# EasyEDA Pro project TK-KB1.eprj

# Schematic Schematic
Create Date: 2023-05-25; Page Name: P1; Project Name: TK-KB1; Schematic Name: Schematic; Update Date: 2023-05-25; Company: 亿航创客; Drawed: 樱落Eglo; Page Size: A5; Version: V1.1
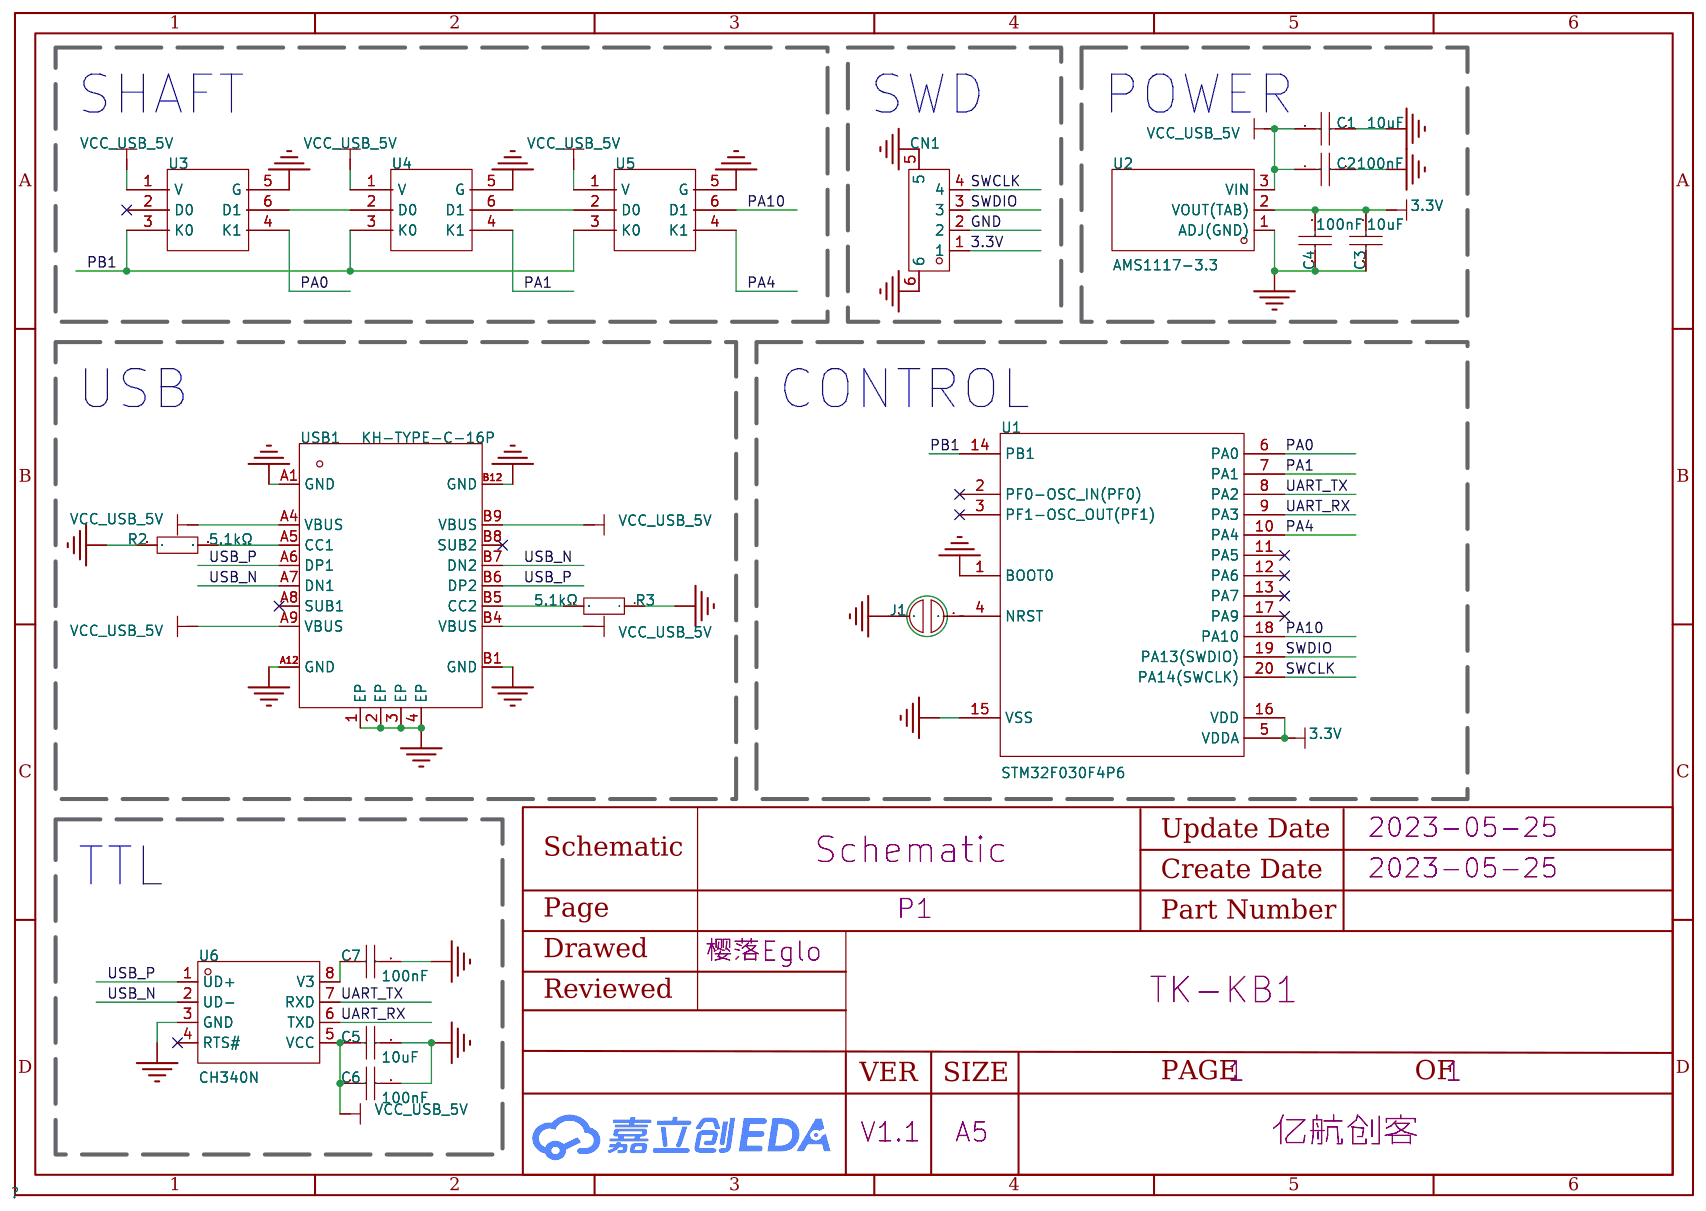
[diagram p0: schematic sheet]

## Parts
C1  10uF  [C0402]
C2  100nF  [C0402]
C3  10uF  [C0402]
C4  100nF  [C0402]
C5  10uF  [C0402]
C6  100nF  [C0402]
C7  100nF  [C0402]
CN1  HDGC1002WR-S-4P  [CONN-SMD_4P-P1.00_HDGC_HDGC1002WR-S-4P]
J1  -  [R0402]
R2  5.1kΩ  [R0402]
R3  5.1kΩ  [R0402]
U1  STM32F030F4P6  [TSSOP-20_L6.5-W4.4-P0.65-LS6.4-BL]
U2  AMS1117-3.3  [SOT-89_L4.5-W2.5-P1.50-LS4.2-BR]
U3  -  [凯华轴座+3528反贴灯]
U4  -  [凯华轴座+3528反贴灯]
U5  -  [凯华轴座+3528反贴灯]
U6  CH340N  [SOP-8_L4.9-W3.9-P1.27-LS6.0-BL]
USB1  KH-TYPE-C-16P  [USB-C-SMD_KH-TYPE-C-16P]

## Library data of the parts
C1 C3 C5 = CL05A106MQ5NUNC: 容值:10uF;精度:±20%;额定电压:6.3V;材质(温度系数):X5R;; LCSC Part Name: 10uF ±20% 6.3V; Supplier Part: C15525; Manufacturer: SAMSUNG(三星); Supplier Footprint: 0402; JLCPCB Part Class: Basic Part; Datasheet: https://atta.szlcsc.com/upload/public/pdf/source/20220823/2B02EE04F8F211D38A52DCB16EB6BEBA.pdf; Supplier: LCSC; Tolerance: ±20%; Voltage Rated: 6.3V; Temperature Coefficient: X5R
C2 C4 C6 C7 = CL05B104KO5NNNC: 容值:100nF;精度:±10%;额定电压:16V;材质(温度系数):X7R;; LCSC Part Name: 100nF ±10% 16V; Supplier Part: C1525; Manufacturer: SAMSUNG(三星); Supplier Footprint: 0402; JLCPCB Part Class: Basic Part; Datasheet: https://atta.szlcsc.com/upload/public/pdf/source/20160103/1457707674891.pdf; Supplier: LCSC; Tolerance: ±10%; Voltage Rated: 16V; Temperature Coefficient: X7R
CN1 = HDGC1002WR-S-4P: SH1.0针座卧贴 4P; LCSC Part Name: SH1.0针座卧贴 4P; Supplier Part: C2936214; Manufacturer: HDGC(华德共创); Supplier Footprint: SMD,P=1mm; JLCPCB Part Class: Extended Part; Datasheet: https://atta.szlcsc.com/upload/public/pdf/source/20211229/E8A09E85670B5E97244D2008A24D97FE.pdf; Supplier: LCSC
J1 = Jumper: 飞线
R2 R3 = 0402WGF5101TCE: 电阻类型:厚膜电阻;阻值:5.1kΩ;精度:±1%;功率:62.5mW;; LCSC Part Name: 5.1kΩ ±1% 62.5mW; Supplier Part: C25905; Manufacturer: UNI-ROYAL(厚声); Supplier Footprint: 0402; JLCPCB Part Class: Basic Part; Datasheet: https://atta.szlcsc.com/upload/public/pdf/source/20200306/C422600_1E6D84923E4A46A82E41ADD87F860B5C.pdf; Supplier: LCSC; Type: 厚膜电阻; Tolerance: ±1%; Power(Watts): 62.5mW; Temperature Coefficient: ±100ppm/℃; Overload Voltage (Max): 50V; Operating Temperature Range: -55℃~+155℃
U1 = STM32F030F4P6: CPU内核:ARM Cortex-M0;CPU最大主频:48MHz;程序存储容量:16KB;程序存储器类型:FLASH;RAM总容量:4KB;GPIO端口数量:15;; LCSC Part Name: ARM Cortex-M0 48MHz; Supplier Part: C32908; Manufacturer: ST(意法半导体); Supplier Footprint: TSSOP-20; JLCPCB Part Class: Extended Part; Datasheet: https://atta.szlcsc.com/upload/public/pdf/source/20140704/1457707098580.pdf; Supplier: LCSC; CPU Core: ARM Cortex-M0; CPU Maximum Speed: 48MHz; Operating Voltage Range: 2.4V~3.6V; Program Storage Size: 16KB; Program Memory Type: FLASH; RAM Size: 4KB; GPIO Ports Number: 15; ADC (Bit): 12bit; Watchdog: 有; Low-Voltage Detect: 有; Direct Memory Access: 有; Internal Oscillator: 有; Operating Temperature Range: -40℃~+85℃
U2 = AMS1117-3.3_C347256: 输出类型:固定;输出极性:正;最大输入电压:18V;输出电压:3.3V;输出电流:1A;电源纹波抑制比(PSRR):60dB@(120Hz);; LCSC Part Name: 输入18V 输出3.3V 1A; Supplier Part: C347256; Manufacturer: UMW(广东友台半导体); Supplier Footprint: SOT-89; JLCPCB Part Class: Extended Part; Datasheet: https://atta.szlcsc.com/upload/public/pdf/source/20211011/50CC665C22E3A66C08379A4A74BDA25C.pdf; Supplier: LCSC; Output Type: 固定; Output Polarity: 正; Number of Outputs: 1; Maximum Input Voltage: 18V; Output Voltage: 3.3V; Dropout Voltage: 1.3V@(1A); Output Current: 1A; Power Supply Rejection Ratio (PSRR): 60dB@(120Hz)
U3-U5 = 凯华轴座+3528反贴灯: 缺口在右下
U6 = CH340N: LCSC Part Name: USB转串口芯片 CH340; Supplier Part: C2977777; Manufacturer: WCH(南京沁恒); Supplier Footprint: SOP-8; JLCPCB Part Class: Extended Part; Datasheet: https://atta.szlcsc.com/upload/public/pdf/source/20220223/82A45E4FF89B3EDCAD50B354450A7EF4.pdf; Supplier: LCSC
USB1 = KH-TYPE-C-16P: 连接器类型:Type-C;标准:-;公母:母座;触点数量:16;端口数量:1;安装方式:卧贴;额定电流 - 电源:3A;工作温度范围:-40℃~+85℃;; LCSC Part Name: Type-C 母座 卧贴; Supplier Part: C709357; Manufacturer: kinghelm(金航标); Supplier Footprint: SMD; JLCPCB Part Class: Extended Part; Datasheet: https://atta.szlcsc.com/upload/public/pdf/source/20200911/C709357_AA8DCEB38BB20E3035A7ED7AE7667837.pdf; Supplier: LCSC; Connector Type: Type-C; Gender: 母座; Number of Contacts: 16; Number of Ports: 1; Mounting Style: 卧贴; Current Rating - Power (Max): 3A; Operating Temperature Range: -40℃~+85℃

## Nets
3.3V: C3.1 C4.1 CN1.1 U1.5(VDDA) U1.16(VDD) U2.2(VOUT(TAB))
GND: C1.2 C2.2 C3.2 C4.2 C5.2 C6.2 C7.2 CN1.2 CN1.5 CN1.6 J1.1 R2.1 R3.1 U1.1(BOOT0) U1.15(VSS) U2.1(ADJ(GND)) U3.5(G) U4.5(G) U5.5(G) U6.3(GND) USB1.1(EP) USB1.2(EP) USB1.3(EP) USB1.4(EP) USB1.A1(GND) USB1.A12(GND) USB1.B1(GND) USB1.B12(GND)
VCC_USB_5V: C1.1 C2.1 C5.1 C6.1 U2.3(VIN) U3.1(V) U4.1(V) U5.1(V) U6.5(VCC) USB1.A4(VBUS) USB1.A9(VBUS) USB1.B4(VBUS) USB1.B9(VBUS)
PA0: U1.6(PA0) U3.4(K1)
PA1: U1.7(PA1) U4.4(K1)
PA4: U1.10(PA4) U5.4(K1)
PA10: U1.18(PA10) U5.6(D1)
PB1: U1.14(PB1) U3.3(K0) U4.3(K0) U5.3(K0)
SWCLK: CN1.4 U1.20(PA14(SWCLK))
SWDIO: CN1.3 U1.19(PA13(SWDIO))
UART_RX: U1.9(PA3) U6.6(TXD)
UART_TX: U1.8(PA2) U6.7(RXD)
USB_N: U6.2(UD-) USB1.A7(DN1) USB1.B7(DN2)
USB_P: U6.1(UD+) USB1.A6(DP1) USB1.B6(DP2)
$1N654: J1.2 U1.4(NRST)
$1N904: R2.2 USB1.A5(CC1)
$1N1037: R3.2 USB1.B5(CC2)
$1N2317: U3.6(D1) U4.2(D0)
$1N2320: U4.6(D1) U5.2(D0)
$1N8614: C7.1 U6.8(V3)

Not connected (* = marked no-connect by the designer): U1 2(PF0-OSC_IN(PF0))* 3(PF1-OSC_OUT(PF1))* 11(PA5)* 12(PA6)* 13(PA7)* 17(PA9)*; U3 2(D0)*; U6 4(RTS#)*; USB1 A8(SUB1)* B8(SUB2)*

## Notes on the sheet
- SHAFT
- SWD
- POWER
- USB
- CONTROL
- TTL

# Board PCB1
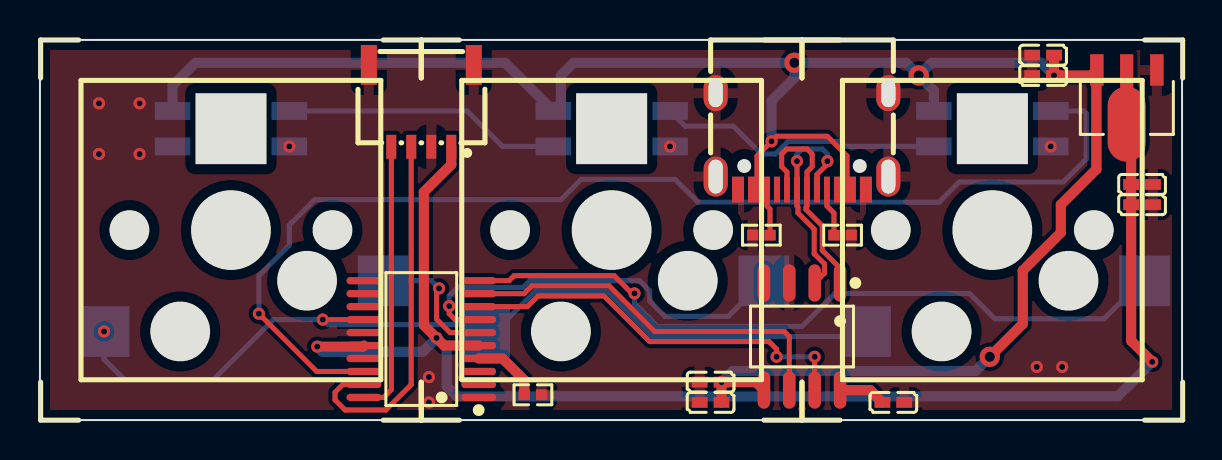
[diagram p1: board, top side]
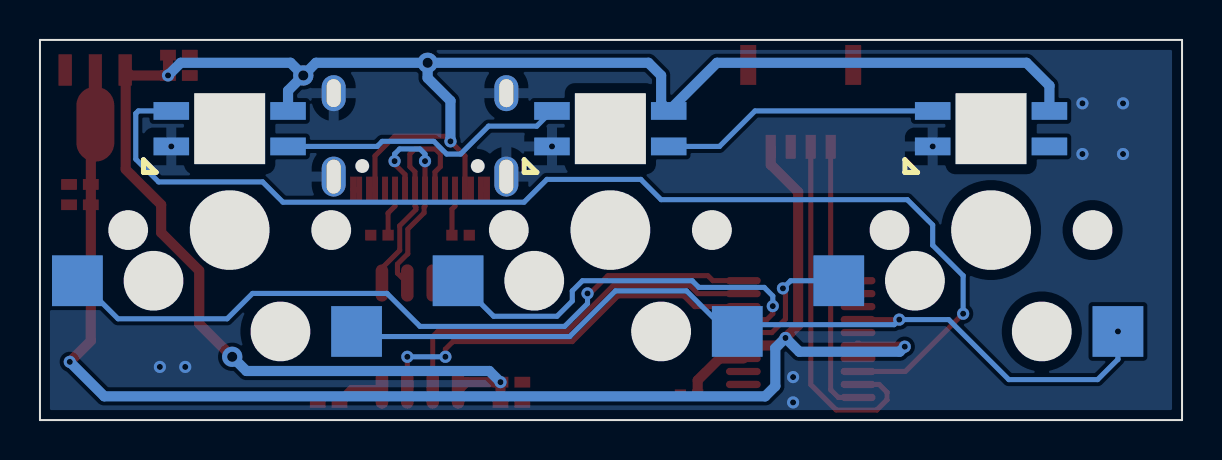
[diagram p2: board, bottom side, seen from below]

Outline 57.15 x 19.05 mm; copper layers: Top Layer, Bottom Layer. Coordinates in mm from the lower left corner of the outline.
Outline path: 0,19.05 57.15,19.05 57.15,0 0,0 0,19.05
Stack: Top Layer 0.035mm / Dielectric1 1.51mm FR4 er 4.5 / Bottom Layer 0.035mm

## Design rules (mm)
net GND: PWR
net $1N654: PWR
net 3.3V: PWR
net VCC_USB_5V: PWR
net $1N904: PWR
net USB_N: DP1
net USB_P: DP1
net $1N1037: PWR
net $1N8614: PWR
template: 自定义配置
spacing copperThickness1oz (default): track to track 0.102, other pairs 0.152 to 0.3
spacing copperThickness2oz: track to track 0.203, other pairs 0.152 to 0.3
track width copperThickness1oz (default): min 0.127, default 0.254, max 2.54
track width copperThickness2oz: min 0.203, default 0.254, max 2.54
track width PWR: min 0.254, default 0.508, max 2.54
differential pair differentialPair (default): width min 0.127, default 0.254, max 2.54; gap min 0.152, default 0.152
via viaSize (default): diameter min 0.5, default 0.61, max 10; hole min 0.3, default 0.305, max 6.299

## Placement (name value [footprint] x y rotation side)
C1  10uF  [C0402]  50.2 18.28 180 top
C2  100nF  [C0402]  50.2 17.27 180 top
C3  10uF  [C0402]  55.15 11.81 0 top
C4  100nF  [C0402]  55.15 10.79 0 top
C5  10uF  [C0402]  33.56 0.89 180 top
C6  100nF  [C0402]  33.56 1.9 180 top
C7  100nF  [C0402]  42.7 0.89 0 top
CN1  HDGC1002WR-S-4P  [CONN-SMD_4P-P1.00_HDGC_HDGC1002WR-S-4P]  19.08 15.74 180 top
J1  -  [R0402]  24.67 1.27 180 top
R2  5.1kΩ  [R0402]  40.16 9.27 180 top
R3  5.1kΩ  [R0402]  36.1 9.27 0 top
U1  STM32F030F4P6  [TSSOP-20_L6.5-W4.4-P0.65-LS6.4-BL]  19.08 4.06 90 top
U2  AMS1117-3.3  [SOT-89_L4.5-W2.5-P1.50-LS4.2-BR]  54.39 16.19 90 top
U3  -  [凯华轴座+3528反贴灯]  9.56 9.52 0 top
U4  -  [凯华轴座+3528反贴灯]  28.61 9.52 0 top
U5  -  [凯华轴座+3528反贴灯]  47.66 9.52 0 top
U6  CH340N  [SOP-8_L4.9-W3.9-P1.27-LS6.0-BL]  38.13 4.19 180 top
USB1  KH-TYPE-C-16P  [USB-C-SMD_KH-TYPE-C-16P]  38.13 13.97 180 top

## Footprints (pads in the part's own frame, mm; a bottom-side part is the same pattern mirrored in y, then rotated)
C0402
  rect 0.79x0.54 smd: 1(-0.545,0) 2(0.545,0)
CONN-SMD_4P-P1.00_HDGC_HDGC1002WR-S-4P
  rect 0.5x1.2 smd: 1(-1.5,2.05) 2(-0.5,2.05) 3(0.5,2.05) 4(1.5,2.05)
  rect 0.8x2 smd: 5(2.625,-2.05) 6(-2.625,-2.05)
R0402
  rect 0.566x0.54 smd: 1(-0.433,0) 2(0.433,0)
SOP-8_L4.9-W3.9-P1.27-LS6.0-BL
  oval 0.63x1.865 smd: 1(-1.905,-2.683) 2(-0.635,-2.683) 3(0.635,-2.683) 4(1.905,-2.683) 5(1.905,2.683) 6(0.635,2.683) 7(-0.635,2.683) 8(-1.905,2.683)
SOT-89_L4.5-W2.5-P1.50-LS4.2-BR
  rect 1.575x0.672 smd: 1(1.356,-1.5) 3(1.356,1.5)
  custom 5.377x1.9 smd: 2(-1.356,0.009)
TSSOP-20_L6.5-W4.4-P0.65-LS6.4-BL
  oval 0.364x1.742 smd: 1(-2.925,-2.871) 2(-2.275,-2.871) 3(-1.625,-2.871) 4(-0.975,-2.871) 5(-0.325,-2.871) 6(0.325,-2.871) 7(0.975,-2.871) 8(1.625,-2.871) 9(2.275,-2.871) 10(2.925,-2.871) 11(2.925,2.871) 12(2.275,2.871) 13(1.625,2.871) 14(0.975,2.871) 15(0.325,2.871) 16(-0.325,2.871) 17(-0.975,2.871) 18(-1.625,2.871) 19(-2.275,2.871) 20(-2.925,2.871)
USB-C-SMD_KH-TYPE-C-16P
  oval 1.2x2 hole 0.7x1.7: 1(-4.32,1.765) 2(4.32,1.765)
  oval 1.2x1.8 hole 0.7x1.4: 3(-4.32,-2.415) 4(4.32,-2.415)
  rect 0.3x1.3 smd: A1(-3.35,2.415) A4(-2.55,2.415) A5(-1.25,2.415) A6(-0.25,2.415) A7(0.25,2.415) A8(1.25,2.415) A9(2.55,2.415) A12(3.35,2.415) B1(3.05,2.415) B4(2.25,2.415) B5(1.75,2.415) B6(0.75,2.415) B7(-0.75,2.415) B8(-1.75,2.415) B9(-2.25,2.415) B12(-3.05,2.415)
凯华轴座+3528反贴灯
  rect 1.778x0.889 smd far side: 1(-2.921,5.969) 2(-2.921,4.191) 5(2.921,4.191) 6(2.921,5.969)
  rect 2.54x2.54 smd far side: 3(-6.35,-5.08) 4(7.62,-2.54)

## Nets
As in the schematic.

Pads without a net: U1 2 3 11 12 13 17; U3 2; U6 4; USB1 A8 B8

## Via types
v1: diameter 0.61, hole 0.305, Top Layer to Bottom Layer, 27 vias
v2: diameter 1.016, hole 0.508, Top Layer to Bottom Layer, 3 vias

## Routing (per net, layer and track width the routed paths; a pad name or vN(x,y) marks a point on that pad's centre or on a via; arc(x,y) is an arc through that point)
3.3V: length 72.7
  Top Layer w0.508: U1.16 16.15,3.68 v1(13.87,3.68) ; 21.95,3.74 20.23,3.74 v1(19.84,4.12) 19.21,4.75 19.21,11.43 20.58,12.8 CN1.1 ; U2.2 54.61,14.61 C3.1 C4.1 54.61,3.97 v1(55.66,2.92)
  Bottom Layer w0.508: v1(13.87,3.68) 14.13,3.43 19.15,3.43 v1(19.84,4.12) 20.35,3.61 20.35,1.7 20.86,1.19 53.93,1.19 v1(55.66,2.92)
GND: length 0.6
  Top Layer w0.254: USB1.A1 USB1.B12 ; USB1.B1 USB1.A12
  vias: v1(2.95,15.87) v1(2.95,13.33) v1(4.98,15.87) v1(4.98,13.33) v1(12.48,13.71) v1(19.46,2.16) v1(19.46,0.89) v1(31.53,13.71) v1(49.88,2.66) v1(50.58,13.71) v1(51.15,2.66)
VCC_USB_5V: length 102.3
  Top Layer w0.254: USB1.A4 USB1.B9 40.38,13.24 39.4,14.22 36.86,14.22 v1(36.61,13.97) 35.88,13.24 USB1.B4 USB1.A9
  Top Layer w0.508: 52.86,17.52 U2.3 ; 52.86,17.52 52.86,12.57 51.09,10.79 51.09,9.39 49.18,7.49 49.18,4.82 v2(47.53,3.17) ; 52.86,17.52 52.61,17.27 v1(50.74,17.27) C1.1 ; C5.1 v1(34.11,1.9) 35.83,1.9 U6.5
  Bottom Layer w0.508: v2(37.75,17.9) 43.34,17.9 v2(43.97,17.27) ; v2(37.75,17.9) 26.7,17.9 26.07,17.27 26.07,15.87 U4.1 23.27,17.9 7.78,17.9 6.64,16.76 U3.1 ; v2(37.75,17.9) 37.75,17.14 36.61,16 v1(36.61,13.97) ; U5.1 44.74,16.51 v2(43.97,17.27) ; v1(34.11,1.9) 34.66,2.46 46.82,2.46 v2(47.53,3.17) ; v2(43.97,17.27) 44.61,17.9 50.11,17.9 v1(50.74,17.27)
PA0: length 6.9
  Top Layer w0.254: v1(19.97,6.6) 19.84,6.47 19.84,5.06 20.52,4.39 21.95,4.39
  Bottom Layer w0.254: v1(19.97,6.6) 19.59,6.98 17.18,6.98
PA1: length 20.3
  Top Layer w0.254: 21.95,5.04 20.77,5.04 20.48,5.33 v1(20.48,5.71)
  Bottom Layer w0.254: 36.23,6.98 34.45,5.2 31.28,5.2 30.51,5.97 30.51,6.47 30,6.98 24.51,6.98 24.18,6.65 20.91,6.65 20.48,6.22 v1(20.48,5.71)
PA4: length 36.8
  Top Layer w0.254: v1(29.75,6.35) 29.62,6.35 28.73,7.24 23.73,7.24 23.48,6.99 21.95,6.99
  Bottom Layer w0.254: v1(29.75,6.35) 29.75,5.84 30.89,4.7 38.13,4.7 39.78,6.35 46.51,6.35 47.78,5.08 53.24,5.08 55.15,6.98 55.28,6.98
PA10: length 57.8
  Top Layer w0.254: v1(10.95,5.33) 13.85,2.44 U1.18
  Bottom Layer w0.254: U5.6 52.23,15.49 52.36,15.36 52.36,13.08 51.21,11.93 46.01,11.93 44.99,10.92 32.92,10.92 31.78,12.06 27.08,12.06 26.07,11.05 13.75,11.05 12.48,9.78 12.48,8.76 10.95,7.24 v1(10.95,5.33)
PB1: length 45.4
  Top Layer w0.254: U1.14 v1(14.15,5.04)
  Bottom Layer w0.254: U5.3 41.05,4.19 30.64,4.19 28.35,6.47 24.8,6.47 22.77,4.44 U4.3 21.92,4.78 14.4,4.78 v1(14.15,5.04) 11.67,5.04 8.67,2.03 4.22,2.03 3.21,3.04 v1(3.21,4.44)
SWCLK: length 13.7
  Top Layer w0.254: CN1.4 17.58,1.52 17.2,1.14 U1.20
SWDIO: length 18.5
  Top Layer w0.254: CN1.3 18.57,13.69 18.57,1.77 17.3,0.5 15.27,0.5 14.76,1.01 14.76,1.39 15.16,1.79 16.21,1.79
UART_RX: length 19.4
  Top Layer w0.254: 21.95,6.34 24.23,6.34 24.62,6.73 28.48,6.73 30.77,4.44 37.24,4.44 37.5,4.19 U6.6
UART_TX: length 20.2
  Top Layer w0.254: v1(36.86,3.17) 36.86,3.55 36.48,3.93 30.51,3.93 28.22,6.22 24.93,6.22 24.39,5.69 21.95,5.69 ; 38.77,1.5 v1(38.77,3.17)
  Bottom Layer w0.254: v1(36.86,3.17) v1(38.77,3.17)
USB_N: length 11
  Top Layer w0.254: USB1.B7 38.88,12.3 39.41,12.83 v1(39.41,12.98) ; 38.77,6.87 39.26,7.36 39.26,7.82 38.74,8.33 38.74,9.57 37.93,10.38 37.93,10.68 37.88,10.72 USB1.A7 v1(37.88,12.98)
  Bottom Layer w0.254: v1(39.41,12.98) 39.41,13.33 39.15,13.59 38.14,13.59 37.88,13.33 v1(37.88,12.98)
USB_P: length 10.9
  Top Layer w0.254: U6.1 40.04,7.61 39.15,8.5 39.15,9.74 38.33,10.55 38.33,10.68 38.38,10.72 USB1.A6 38.39,11.56 38.39,12.44 38.64,12.7 38.64,13.33 38.39,13.59 37.37,13.59 37.12,13.33 37.12,12.7 37.38,12.43 USB1.B6
$1N654: length 3.5
  Top Layer w0.508: J1.2 24.24,1.99 23.15,3.09 21.95,3.09
$1N904: length 2.4
  Top Layer w0.254: USB1.A5 39.38,10.72 39.73,10.38 R2.2
$1N1037: length 2.3
  Top Layer w0.254: USB1.B5 36.38,10.72 36.53,10.57 R3.2
$1N2317: length 13.9
  Bottom Layer w0.254: U3.6 21.37,15.49 23.15,13.71 U4.2
$1N2320: length 14.5
  Bottom Layer w0.254: U5.2 40.28,13.71 40.02,13.97 37.43,13.97 36.8,13.33 36.1,13.33 34.7,14.73 32.29,14.73 U4.6
$1N8614: length 2.4
  Top Layer w0.508: U6.8 41.54,1.5 C7.1

## Copper pours and planes (outline as drawn; the poured copper is in the pictures)
GND on Top Layer: 0.03,19.05 57.18,19.05 57.18,0 0.03,0
GND on Bottom Layer: 0.03,19.05 57.18,19.05 57.18,0 0.03,0
